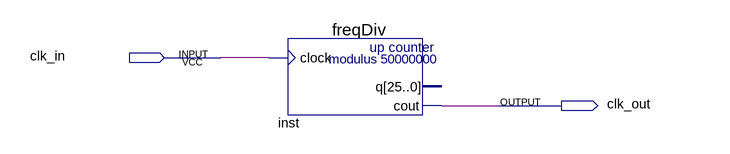
[diagram p0: schematic sheet]
// Quartus schematic FreqDivider.bdf as structural Verilog: 1 symbols, 2 pins
module FreqDivider (
  input  clk_in,
  output clk_out
);

  freqDiv inst (.clock(clk_in), .cout(clk_out));  // open: q
endmodule
